# Altium schematic sheet Bluetooth.SchDoc
size A4; SheetNumber: 2; SheetTotal: 2
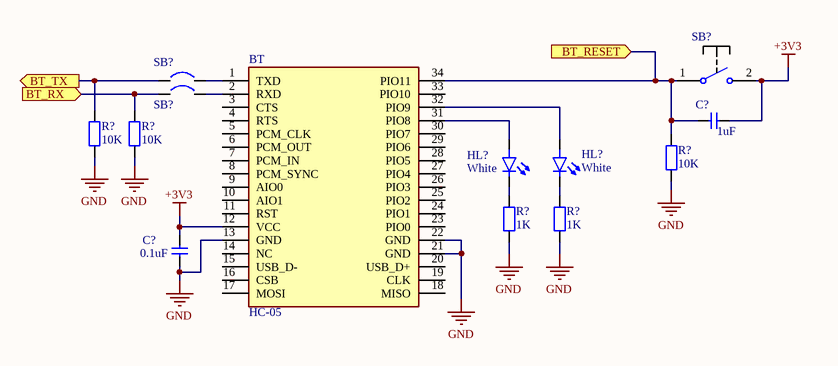
[diagram p0: Bluetooth.SchDoc]

## Parts
(Parts that share a designator on the sheet are numbered #1, #2 ... from top to bottom, then left to right.)
BT  HC-05  [HC-05]
C?#1  1uF  [CAP0805]
C?#2  0.1uF  [CAP0805]
HL?#1  White  [LED0805_WHITE]
HL?#2  White  [LED0805_WHITE]
R?#1  10K  [RES0805]
R?#2  10K  [RES0805]
R?#3  10K  [RES0805]
R?#4  1K  [RES0805]
R?#5  1K  [RES0805]
SB?#1  Solder Bridge  [Solder Bridge]  (value not drawn)
SB?#2  Button x2  [BUTTON_3x6]  (value not drawn)
SB?#3  Solder Bridge  [Solder Bridge]  (value not drawn)

## Ports
BT_RESET (in), BT_RX (in), BT_TX (out)

## Nets
+3V3: BT.12(VCC) C?#1.2 C?#2.2 SB?#2.2
GND: BT.13(GND) BT.21(GND) BT.22(GND) C?#2.1 R?#1.2 R?#2.2 R?#3.1 R?#4.1 R?#5.1
BT_RESET: BT.34(PIO11) C?#1.1 R?#3.2 SB?#2.1 ; port BT_RESET
BT_RX: R?#2.1 SB?#3.1 ; port BT_RX
BT_TX: R?#1.1 SB?#1.1 ; port BT_TX
NetBT_1: BT.1(TXD) SB?#1.2
NetBT_2: BT.2(RXD) SB?#3.2
NetBT_31: BT.31(PIO8) HL?#1.2(A)
NetBT_32: BT.32(PIO9) HL?#2.2(A)
NetHL?#1_1: HL?#1.1(K) R?#4.2
NetHL?#2_1: HL?#2.1(K) R?#5.2

Not connected (* = marked no-connect by the designer): BT 3(CTS) 4(RTS) 5(PCM_CLK) 6(PCM_OUT) 7(PCM_IN) 8(PCM_SYNC) 9(AIO0) 10(AIO1) 11(RST) 14(NC) 15(USB_D-) 16(CSB) 17(MOSI) 18(MISO) 19(CLK) 20(USB_D+) 23(PIO0) 24(PIO1) 25(PIO2) 26(PIO3) 27(PIO4) 28(PIO5) 29(PIO6) 30(PIO7) 33(PIO10)

## Library data of the parts
BT = HC-05: Bluetooth HC-05; ComponentLink1Description: Chipdip; ComponentLink1URL: https://www.chipdip.ru/product0/8020390968
C?#1 C?#2 = CAP Ceramic: Ceramic SMD Cap
HL?#1 HL?#2 = LED: LED smd
R?#1-R?#5 = RES: RES smd
SB?#2 = Button x2: 2 pad smd tact button